# EAGLE design Zypher PCB (EAGLE 9.3.2)
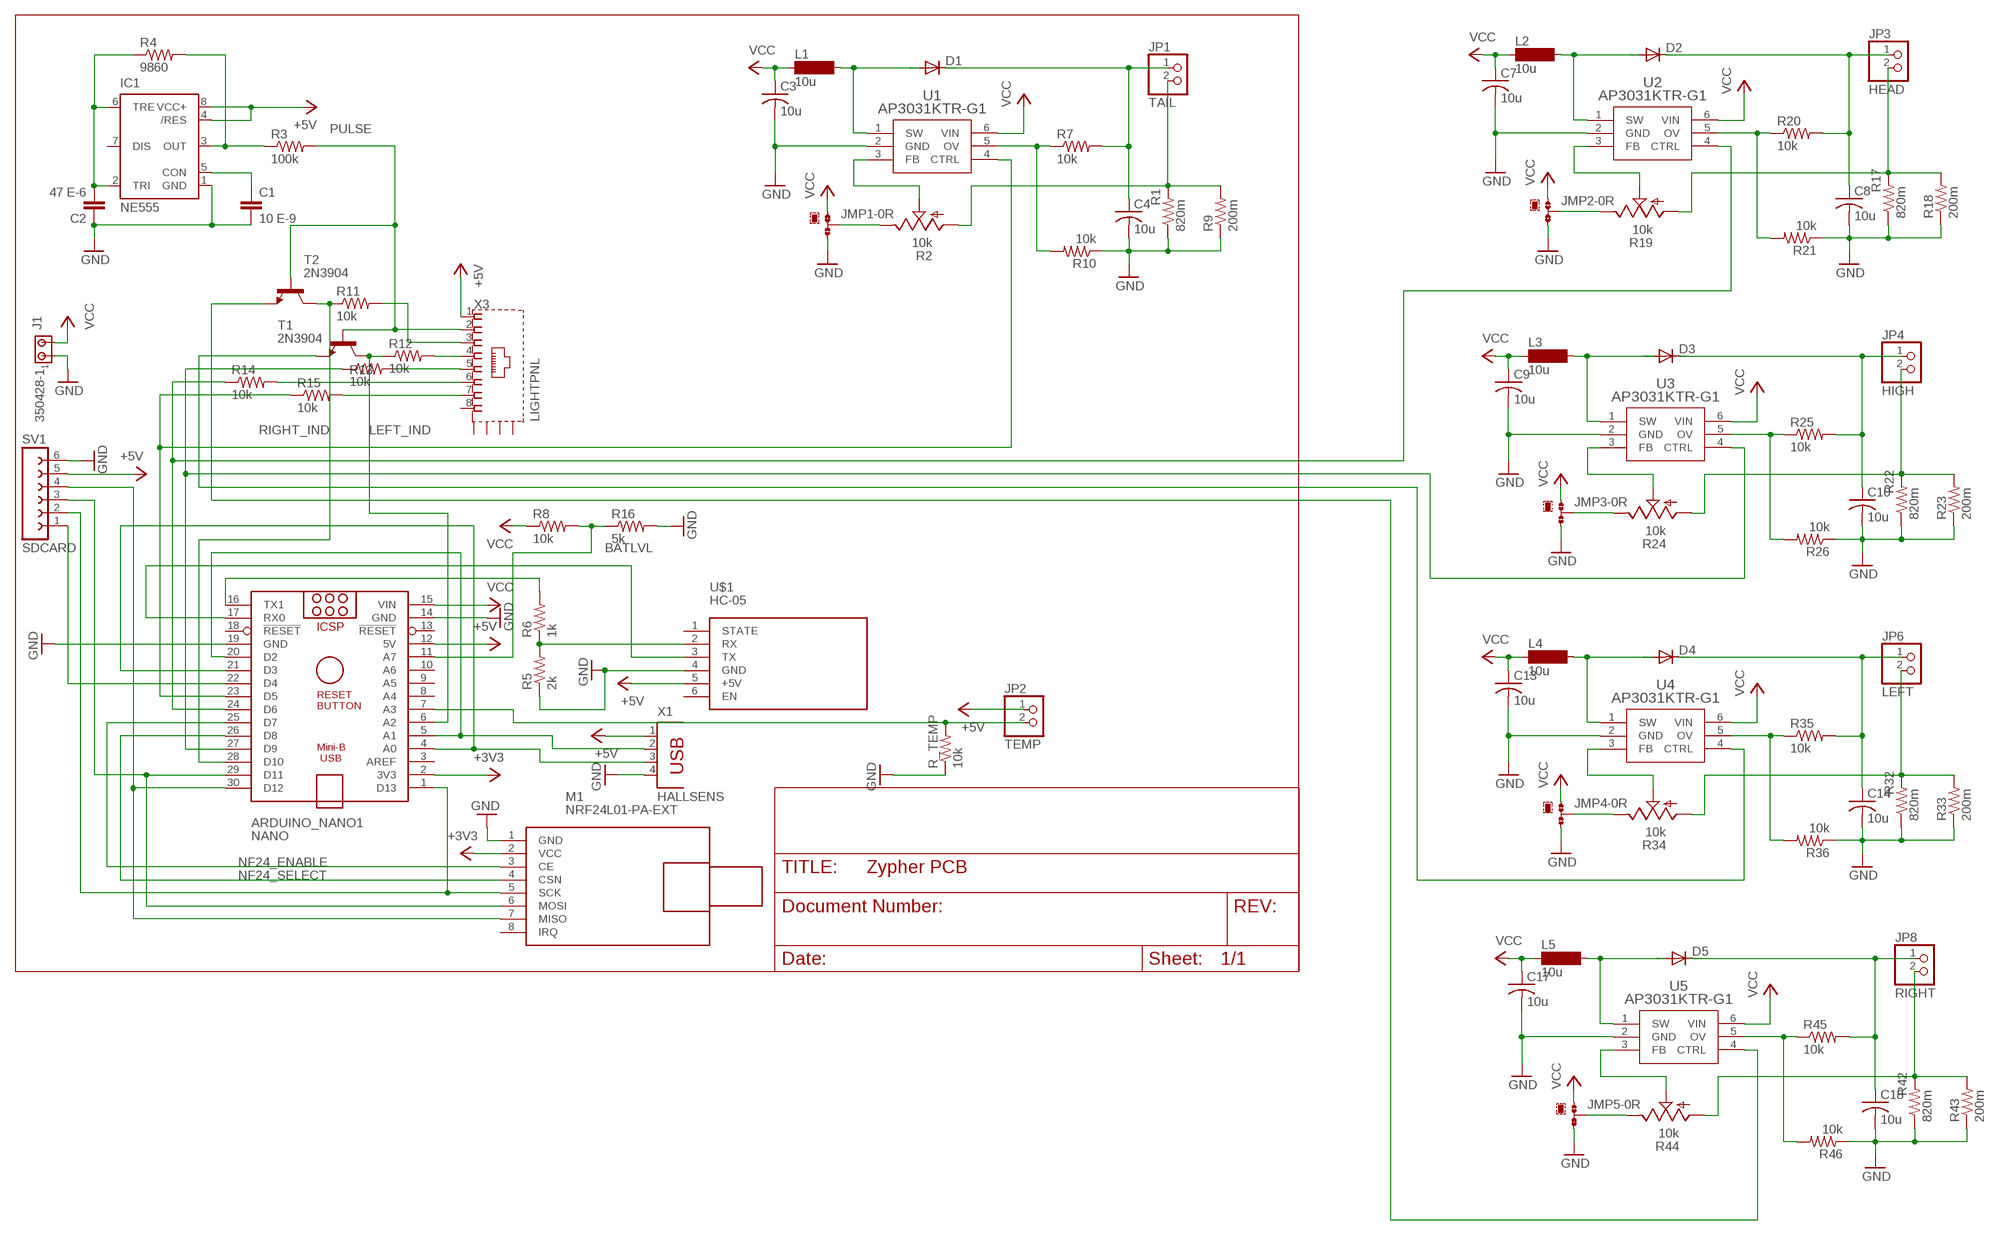
[diagram p0: schematic, sheet 1]

## Parts
ARDUINO_NANO1  NANO  ARDUINO_NANO  [ARDUINO_NANO]
C1  10 E-9  C2.5/5  [C2.5-5]
C2  47 E-6  C2.5/5  [C2.5-5]
C3  10u  C-USC1206K  [C1206K]
C4  10u  C-USC1206K  [C1206K]
C7  10u  C-USC1206K  [C1206K]
C8  10u  C-USC1206K  [C1206K]
C9  10u  C-USC1206K  [C1206K]
C10  10u  C-USC1206K  [C1206K]
C13  10u  C-USC1206K  [C1206K]
C14  10u  C-USC1206K  [C1206K]
C17  10u  C-USC1206K  [C1206K]
C18  10u  C-USC1206K  [C1206K]
D1  DIODE-DO-214AC  [DO-214AC]
D2  DIODE-DO-214AC  [DO-214AC]
D3  DIODE-DO-214AC  [DO-214AC]
D4  DIODE-DO-214AC  [DO-214AC]
D5  DIODE-DO-214AC  [DO-214AC]
IC1  NE555  [DIL-08]
J1  350428-1  [350428-1]
JMP1  0R-JUMPA  [A0R-JMP]
JMP2  0R-JUMPA  [A0R-JMP]
JMP3  0R-JUMPA  [A0R-JMP]
JMP4  0R-JUMPA  [A0R-JMP]
JMP5  0R-JUMPA  [A0R-JMP]
JP1  TAIL  PINHD-1X2  [1X02]
JP2  TEMP  PINHD-1X2  [1X02]
JP3  HEAD  PINHD-1X2  [1X02]
JP4  HIGH  PINHD-1X2  [1X02]
JP6  LEFT  PINHD-1X2  [1X02]
JP8  RIGHT  PINHD-1X2  [1X02]
L1  10u  SD12K100  [SD12K100]
L2  10u  SD12K100  [SD12K100]
L3  10u  SD12K100  [SD12K100]
L4  10u  SD12K100  [SD12K100]
L5  10u  SD12K100  [SD12K100]
M1  NRF24L01-PA-EXT  WIRELESS-NRF24L01-PA-EXT  [WIRELESS-NRF24L01-PA-EXT]
R1  820m  R-US_R0603  [R0603]
R2  10k  TRIM_US-RJ9W  [RJ9W]
R3  100k  R-US_0207/7  [0207/7]
R4  9860  R-US_0207/7  [0207/7]
R5  2k  R-US_0204/7  [0204/7]
R6  1k  R-US_0204/7  [0204/7]
R7  10k  R-US_0207/2V  [0207/2V]
R8  10k  R-US_0207/7  [0207/7]
R9  200m  R-US_R0805  [R0805]
R10  10k  R-US_0207/2V  [0207/2V]
R11  10k  R-US_0207/7  [0207/7]
R12  10k  R-US_0207/7  [0207/7]
R13  10k  R-US_0207/7  [0207/7]
R14  10k  R-US_0207/7  [0207/7]
R15  10k  R-US_0207/7  [0207/7]
R16  5k  R-US_0207/7  [0207/7]
R17  820m  R-US_R0603  [R0603]
R18  200m  R-US_R0805  [R0805]
R19  10k  TRIM_US-RJ9W  [RJ9W]
R20  10k  R-US_0207/2V  [0207/2V]
R21  10k  R-US_0207/2V  [0207/2V]
R22  820m  R-US_R0603  [R0603]
R23  200m  R-US_R0805  [R0805]
R24  10k  TRIM_US-RJ9W  [RJ9W]
R25  10k  R-US_0207/2V  [0207/2V]
R26  10k  R-US_0207/2V  [0207/2V]
R32  820m  R-US_R0603  [R0603]
R33  200m  R-US_R0805  [R0805]
R34  10k  TRIM_US-RJ9W  [RJ9W]
R35  10k  R-US_0207/2V  [0207/2V]
R36  10k  R-US_0207/2V  [0207/2V]
R42  820m  R-US_R0603  [R0603]
R43  200m  R-US_R0805  [R0805]
R44  10k  TRIM_US-RJ9W  [RJ9W]
R45  10k  R-US_0207/2V  [0207/2V]
R46  10k  R-US_0207/2V  [0207/2V]
R_TEMP  10k  R-US_0207/7  [0207/7]
SV1  SDCARD  FE06W  [FE06W]
T1  2N3904  [TO92]
T2  2N3904  [TO92]
U1  AP3031KTR-G1  [SOT23-6]
U2  AP3031KTR-G1  [SOT23-6]
U3  AP3031KTR-G1  [SOT23-6]
U4  AP3031KTR-G1  [SOT23-6]
U5  AP3031KTR-G1  [SOT23-6]
U$1  HC-05  WIRELESS-BLUETOOTH-HC-05  [WIRELESS-BLUETOOTH-HC-05]
X1  HALLSENS  PN87520  [PN87520]
X3  LIGHTPNL  RJ45-6L21-S  [RJ45-SHIELD1]

## Nets
+3V3: ARDUINO_NANO1.2(3V3) M1.2(VCC)
+5V: ARDUINO_NANO1.12(5V) IC1.4(/RES) IC1.8(VCC+) JP2.1 SV1.5 U$1.5(+5V) X1.1 X3.1
BATLVL: ARDUINO_NANO1.11(A7) R8.2 R16.1
CLK: ARDUINO_NANO1.1(D13) M1.5(SCK) SV1.2
GND: ARDUINO_NANO1.14(GND) ARDUINO_NANO1.19(GND) C1.2 C2.1 C3.2 C4.2 C7.2 C8.2 C9.2 C10.2 C13.2 C14.2 C17.2 C18.2 IC1.1(GND) J1.1 JMP1.3 JMP2.3 JMP3.3 JMP4.3 JMP5.3 M1.1(GND) R1.1 R5.1 R9.1 R10.1 R16.2 R17.1 R18.1 R21.1 R22.1 R23.1 R26.1 R32.1 R33.1 R36.1 R42.1 R43.1 R46.1 R_TEMP.1 SV1.6 U1.2(GND) U2.2(GND) U3.2(GND) U4.2(GND) U5.2(GND) U$1.4(GND) X1.4
HALL1: ARDUINO_NANO1.4(A0) ARDUINO_NANO1.21(D3) X1.3
HALL2: ARDUINO_NANO1.5(A1) ARDUINO_NANO1.20(D2) X1.2
HEAD_CTRL: ARDUINO_NANO1.24(D6) R14.1 U2.4(CTRL)
HIGH_CTRL: ARDUINO_NANO1.27(D9) R13.1 U3.4(CTRL)
LEFT+: C14.1 D4.C JP6.1 R35.2
LEFT-: JP6.2 R32.2 R33.2 R34.A
LEFT_CTRL: T1.3(E) U4.4(CTRL)
LEFT_IND: ARDUINO_NANO1.6(A2) R12.1 T1.1(C)
MISO: ARDUINO_NANO1.30(D12) M1.7(MISO) SV1.4
MOSI: ARDUINO_NANO1.29(D11) M1.6(MOSI) SV1.3
N$1: D1.A L1.2 U1.1(SW)
N$2: C1.1 IC1.5(CON)
N$3: C4.1 D1.C JP1.1 R7.2
N$4: C2.2 IC1.2(TRI) IC1.6(TRE) R4.1
N$5: IC1.3(OUT) R3.1 R4.2
N$6: R2.S U1.3(FB)
N$7: JP1.2 R1.2 R2.A R9.2
N$8: JMP1.2 R2.E
N$12: R5.2 R6.1 U$1.2(RX)
N$20: R7.1 R10.2 U1.5(OV)
N$26: R14.2 X3.6
N$28: R13.2 X3.5
N$29: R11.2 X3.3
N$30: R12.2 X3.4
N$31: R15.2 X3.7
N$35: D2.A L2.2 U2.1(SW)
N$36: C8.1 D2.C JP3.1 R20.2
N$37: JP3.2 R17.2 R18.2 R19.A
N$38: R19.S U2.3(FB)
N$39: JMP2.2 R19.E
N$40: R20.1 R21.2 U2.5(OV)
N$42: D3.A L3.2 U3.1(SW)
N$43: C10.1 D3.C JP4.1 R25.2
N$44: JP4.2 R22.2 R23.2 R24.A
N$45: R24.S U3.3(FB)
N$46: JMP3.2 R24.E
N$47: R25.1 R26.2 U3.5(OV)
N$56: D4.A L4.2 U4.1(SW)
N$59: R34.S U4.3(FB)
N$60: JMP4.2 R34.E
N$61: R35.1 R36.2 U4.5(OV)
N$70: D5.A L5.2 U5.1(SW)
N$73: R44.S U5.3(FB)
N$74: JMP5.2 R44.E
N$75: R45.1 R46.2 U5.5(OV)
NF24_ENABLE: ARDUINO_NANO1.25(D7) M1.3(CE)
NF24_SELECT: ARDUINO_NANO1.26(D8) M1.4(CSN)
PULSE: R3.2 T1.2(B) T2.2(B) X3.2
RIGHT+: C18.1 D5.C JP8.1 R45.2
RIGHT-: JP8.2 R42.2 R43.2 R44.A
RIGHT_CTRL: T2.3(E) U5.4(CTRL)
RIGHT_IND: ARDUINO_NANO1.28(D10) R11.1 T2.1(C)
RX: ARDUINO_NANO1.17(RX0) U$1.3(TX)
SD_SEL: ARDUINO_NANO1.22(D4) SV1.1
TAIL_CTRL: ARDUINO_NANO1.23(D5) R15.1 U1.4(CTRL)
TEMP: ARDUINO_NANO1.7(A3) JP2.2 R_TEMP.2
TX: ARDUINO_NANO1.16(TX1) R6.2
VCC: ARDUINO_NANO1.15(VIN) C3.1 C7.1 C9.1 C13.1 C17.1 J1.2 JMP1.1 JMP2.1 JMP3.1 JMP4.1 JMP5.1 L1.1 L2.1 L3.1 L4.1 L5.1 R8.1 U1.6(VIN) U2.6(VIN) U3.6(VIN) U4.6(VIN) U5.6(VIN)
Unconnected: ARDUINO_NANO1.3(AREF) ARDUINO_NANO1.8(A4) ARDUINO_NANO1.9(A5) ARDUINO_NANO1.10(A6) ARDUINO_NANO1.13(!RESET) ARDUINO_NANO1.18(!RESET) IC1.7(DIS) M1.8(IRQ) U$1.1(STATE) U$1.6(EN) X3.8 X3.S1(S) X3.S2(S) X3.S3(S) X3.S4(S)

## Library data of the parts
ARDUINO_NANO1 = MIE346, Design Assignment 3 - ArduinoNanoV40:ARDUINO_NANO: Arduino Nano V3.0 Overview: The Arduino Nano is a small, complete, and breadboard-friendly board based on the ATmega328 (Arduino Nano 3.x) or ATmega168 (Arduino Nano 2.x). It has more or less the same functionality of the Arduino Duemilanove, but in a different package. It lacks only a DC power jack, and works with a Mini-B USB cable instead of a standard one. The Nano was designed and is being produced by Gravitech. Specifications: Microcontroller Atmel ATmega168 or ATmega328 Operating Voltage (logic level) 5 V Input Voltage (recommended) 7-12 V Input Voltage (limits) 6-20 V Digital I/O Pins 14 (of which 6 provide PWM output) Analog Input Pins 8 DC Current per I/O Pin 40 mA Flash Memory 16 KB (ATmega168) or 32 KB (ATmega328) of which 2 KB used by bootloader SRAM 1 KB (ATmega168) or 2 KB (ATmega328) EEPROM 512 bytes (ATmega168) or 1 KB (ATmega328) Clock Speed 16 MHz Dimensions 0.73" x 1.70" Length 45 mm Width 18 mm Weigth 5 g Power: The Arduino Nano can be powered via the Mini-B USB connection, 6-20V unregulated external power supply (pin 30), or 5V regulated external power supply (pin 27). The power source is automatically selected to the highest voltage source. Memory: The ATmega168 has 16 KB of flash memory for storing code (of which 2 KB is used for the bootloader); the ATmega328 has 32 KB, (also with 2 KB used for the bootloader). The ATmega168 has 1 KB of SRAM and 512 bytes of EEPROM (which can be read and written with the EEPROM library); the ATmega328 has 2 KB of SRAM and 1 KB of EEPROM. Input and Output: Each of the 14 digital pins on the Nano can be used as an input or output, using pinMode(), digitalWrite(), and digitalRead() functions. They operate at 5 volts. Each pin can provide or receive a maximum of 40 mA and has an internal pull-up resistor (disconnected by default) of 20-50 kOhms. In addition, some pins have specialized functions. Visit Arduino - ArduinoBoardNano <https://www.arduino.cc/en/Main/ArduinoBoardNano>
C1 C2 = capacitor-wima:C: CAPACITOR naming: grid - package width
C3 C4 C7-C10 C13 C14 C17 C18 = rcl:C-US: CAPACITOR, American symbol; SPICEPREFIX: C
D1-D5 = diode:DIODE-: DIODE
IC1 = st-microelectronics:NE555: General purpose bipolar Timer; MF: Arrow Electronics; MPN: NE555N; OC_FARNELL: 1467742; OC_NEWARK: 89K1486
J1 = con-amp:350428-1: Universal MATE-N-LOK .250" Centerline, 600 V, 19 - 36 A max Source: http://catalog.tycoelectronics.com/ .. ENG_CD_350428_Y.pdf
JMP1-JMP5 = jump-0r-smd:0R-JUMP: SMD 0R 0805 Jumper
JP1-JP4 JP6 JP8 = pinhead:PINHD-1X2: PIN HEADER
L1-L5 = inductor-neosid:SD12: INDUCTOR nominal inductance; OC_FARNELL: unknown; OC_NEWARK: unknown
M1 = diy-modules:WIRELESS-NRF24L01-PA-EXT: 2.4 GHz Wireless Module based on NRF24L01 chip with preamplifier and external antenna Click here to find device on ebay.com <http://www.ebay.com/sch/nrf24l01+pa+lna+sma>
R1 R7 R9 R10 R17 R18 R20-R23 R25 R26 R32 R33 R35 R36 R42 R43 R45 R46 = resistor:R-US_: RESISTOR, American symbol
R2 R19 R24 R34 R44 = pot:TRIM_US-: POTENTIOMETER
R3-R6 R8 R11-R16 R_TEMP = rcl:R-US_: RESISTOR, American symbol; SPICEPREFIX: R
SV1 = con-lsta:FE06W: FEMALE HEADER; OC_FARNELL: unknown; OC_NEWARK: unknown
T1 T2 = transistor:2N3904: NPN TRANSISTOR
U1-U5 = Lighting IC:AP3031KTR-G1: AP3031 step-up LED driver chip for LEDs up to 1.4A; MANUFACTURER_PART_NUMBER: AP3031KTRG1; VENDOR: Diodes Inc
U$1 = diy-modules:WIRELESS-BLUETOOTH-HC-05: Bluetooth Transceiver Module based on HC-05 board Tutorial is available here: https://arduino-info.wikispaces.com/BlueTooth-HC05-HC06-Modules-How-To Click here to find device on ebay.com <http://www.ebay.com/sch/hc-05+module+rs232>
X1 = con-berg:PN87520: BERG USB connector; OC_FARNELL: unknown; OC_NEWARK: unknown
X3 = con-tycoelectronics:RJ45*2: RJ45 Low Profile Shield Type 2 For all RJ45 L, LC, LCT and X Series Models Source: www.tycoelectronics.com .. ENG_DS_1654001_1099_RJ_L_0507.pdf; OC_FARNELL: unknown; OC_NEWARK: unknown

## Net classes
0 default: width 0.254 mm, clearance 0.152 mm

## Board
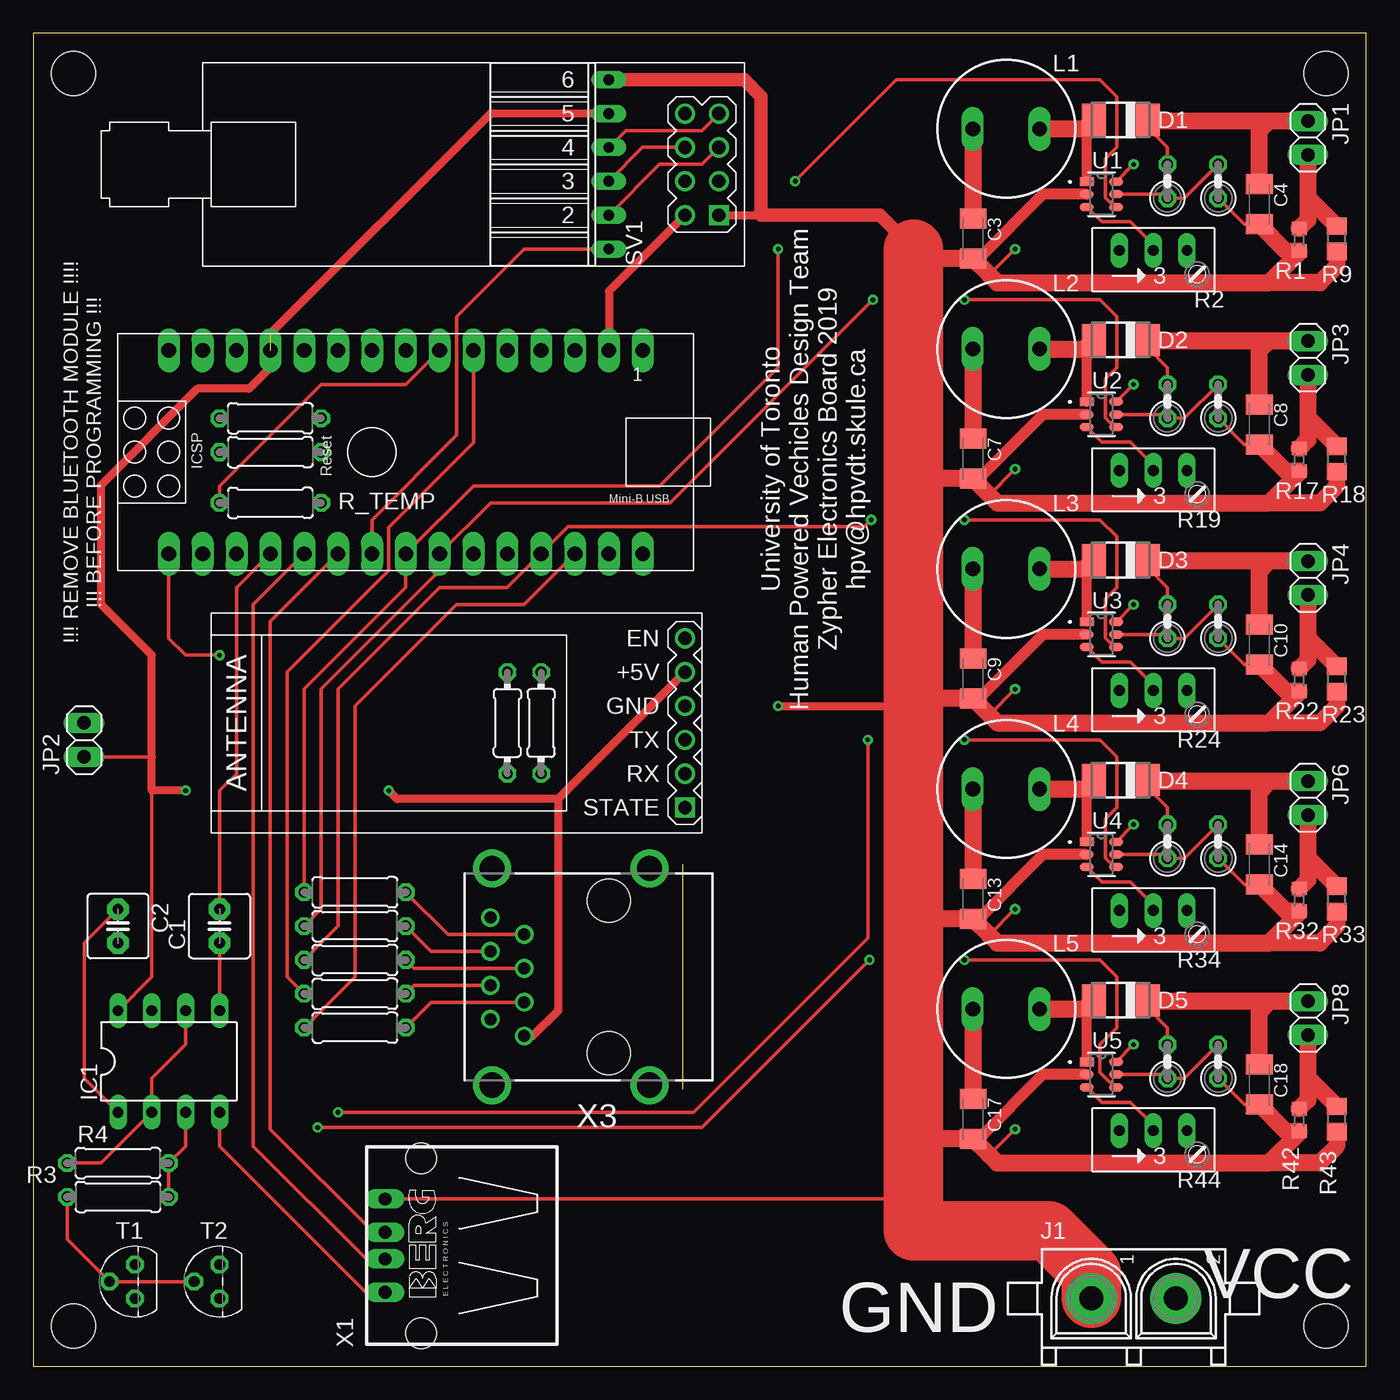
[diagram p1: board, top side]
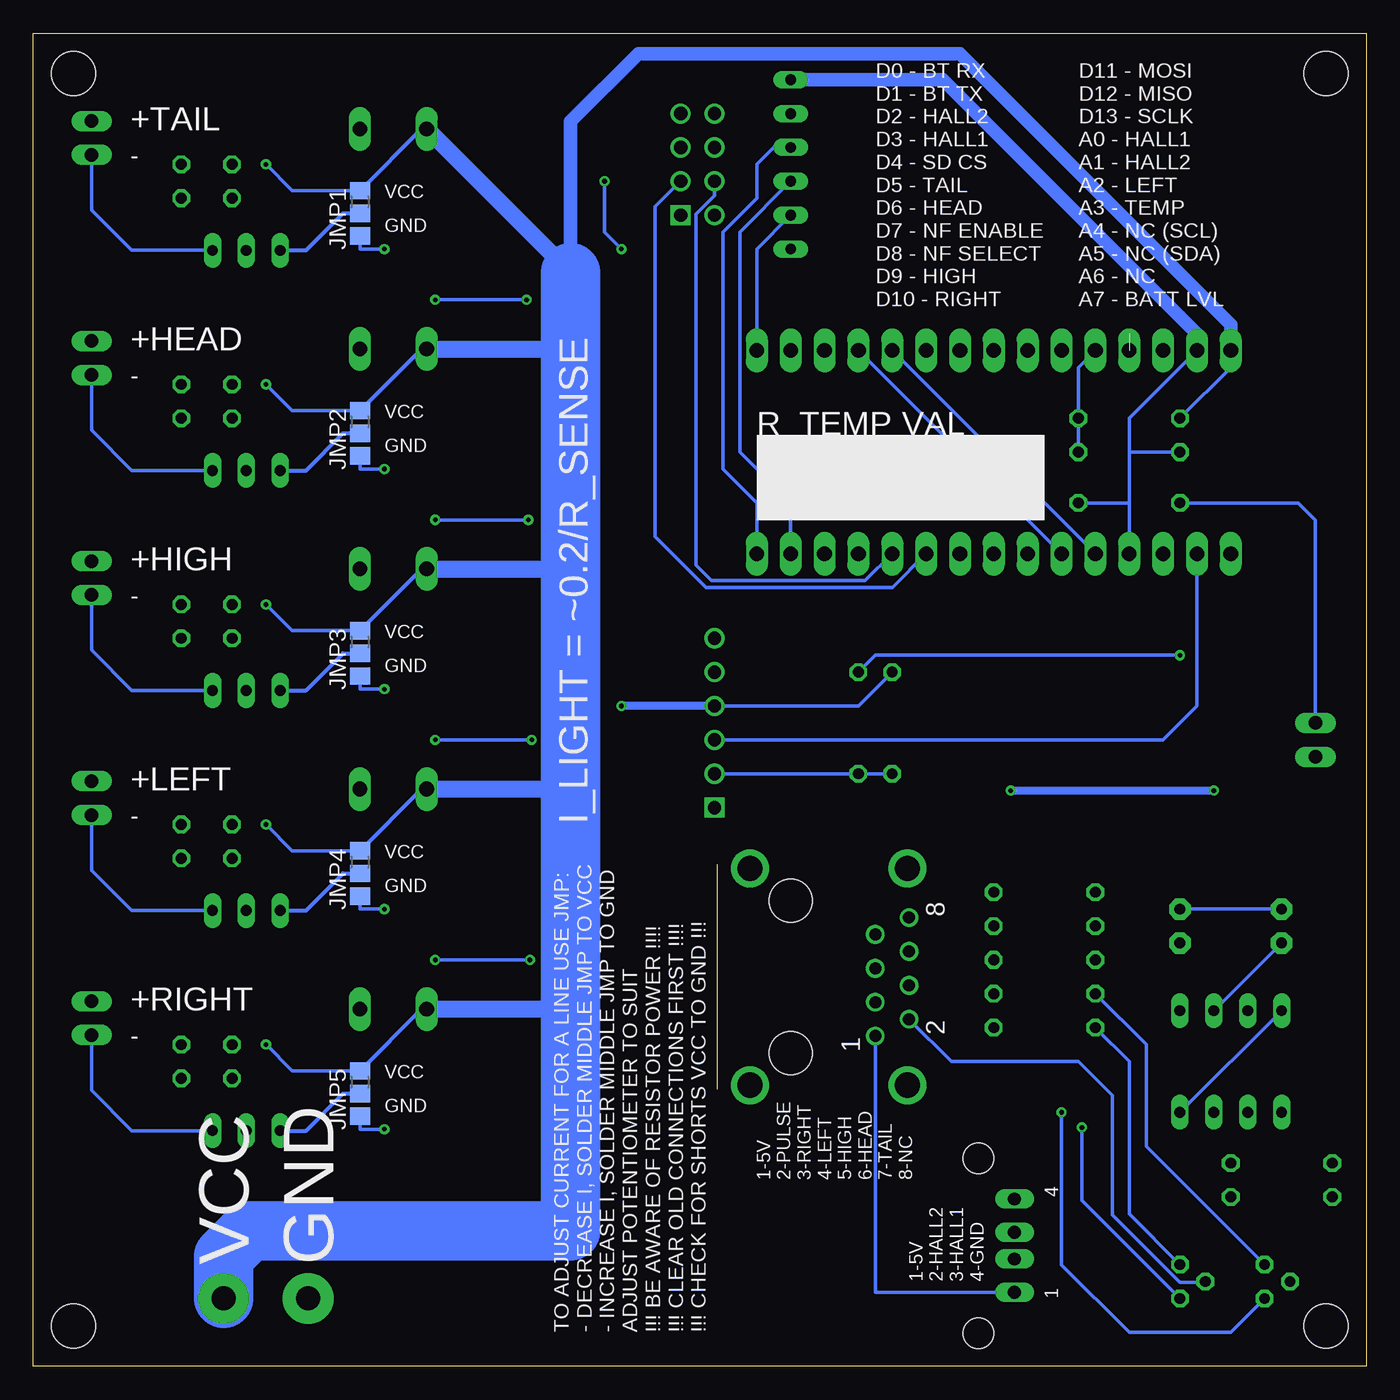
[diagram p2: board, bottom side, seen from below]

Size 100 x 100 mm. Coordinates in mm from the lower left corner, seen from the top.
Outline: 0,0 100,0 100,100 0,100 0,0
Copper layers (1*16): Top 0.035mm / dielectric 1.5mm / Bottom 0.035mm
Design rules "default *": minimum track width 10mil, minimum drill 0.35mm, track to track 6mil, track to pad 6mil, pad to pad 6mil, via to via 6mil, smd to smd 6mil, copper to edge 40mil, drill to drill 6mil, minimum pad ring 10mil, minimum via ring 8mil, stop-mask expansion 4mil, vias tented up to drill 0mil, thermal gap 10mil
Holes 3.3 mm at 3,97 97,3 3,3 97,97

### Footprints (pad centres in the part's own frame; a part is rotated, then mirrored left to right if it is on the bottom)
ARDUINO_NANO = drill 1.1 long: 1 -20.32,-7.62; 2 -17.78,-7.62; 3 -15.24,-7.62; 4 -12.7,-7.62; 5 -10.16,-7.62; 6 -7.62,-7.62; 7 -5.08,-7.62; 8 -2.54,-7.62; 9 0,-7.62; 10 2.54,-7.62; 11 5.08,-7.62; 12 7.62,-7.62; 13 10.16,-7.62; 14 12.7,-7.62; 15 15.24,-7.62; 16 15.24,7.62; 17 12.7,7.62; 18 10.16,7.62; 19 7.62,7.62; 20 5.08,7.62; 21 2.54,7.62; 22 0,7.62; 23 -2.54,7.62; 24 -5.08,7.62; 25 -7.62,7.62; 26 -10.16,7.62; 27 -12.7,7.62; 28 -15.24,7.62; 29 -17.78,7.62; 30 -20.32,7.62
C2.5-5 = drill 0.813 pad 1.6 octagon: 1 -1.27,0; 2 1.27,0
C1206K = smd 1.5 x 2: 1 -1.5,0; 2 1.5,0
DO-214AC = smd 1.8 x 2.4: A 2.025,0; C -2.025,0
DIL-08 = drill 0.813 long: 1 -3.81,-3.81; 2 -1.27,-3.81; 3 1.27,-3.81; 4 3.81,-3.81; 5 3.81,3.81; 6 1.27,3.81; 7 -1.27,3.81; 8 -3.81,3.81
350428-1 = drill 1.8 pad 3.81: 1 -3.175,0; 2 3.175,0
A0R-JMP = smd 1.5 x 1.3: 1 0,1.7; 2 0,0; 3 0,-1.7
1X02 = drill 1.016 long: 1 -1.27,0; 2 1.27,0
SD12K100 = drill 1.1 long: 1 -2.5,0; 2 2.5,0
WIRELESS-NRF24L01-PA-EXT = drill 1 square: 1 -18.415,3.81 | drill 1: 2 -15.875,3.81; 3 -18.415,1.27; 4 -15.875,1.27; 5 -18.415,-1.27; 6 -15.875,-1.27; 7 -18.415,-3.81; 8 -15.875,-3.81
R0603 = smd 1 x 1.1: 1 -0.85,0; 2 0.85,0
RJ9W = drill 0.813 long: A 2.54,0.635; E -2.54,0.635; S 0,0.635
0207/7 = drill 0.813 octagon: 1 -3.81,0; 2 3.81,0
0204/7 = drill 0.813 octagon: 1 -3.81,0; 2 3.81,0
0207/2V = drill 0.813 octagon: 1 -1.27,0; 2 1.27,0
R0805 = smd 1.3 x 1.5: 1 -0.95,0; 2 0.95,0
FE06W = drill 0.813 long: 1 -6.35,0; 2 -3.81,0; 3 -1.27,0; 4 1.27,0; 5 3.81,0; 6 6.35,0
TO92 = drill 0.813 octagon: 1 1.27,0; 2 0,1.905; 3 -1.27,0
SOT23-6 = smd 1.06 x 0.65: 1 -1.1,0.95; 2 -1.1,0; 3 -1.1,-0.95; 4 1.1,-0.95; 5 1.1,0; 6 1.1,0.95
WIRELESS-BLUETOOTH-HC-05 = drill 1 square: 1 -6.35,-17.145 | drill 1: 2 -3.81,-17.145; 3 -1.27,-17.145; 4 1.27,-17.145; 5 3.81,-17.145; 6 6.35,-17.145
PN87520 = drill 0.95 long: 1 -3.5,2.71; 2 -1,2.71; 3 1,2.71; 4 3.5,2.71 | hole 2.3: -6.57,0; 6.57,0
RJ45-SHIELD1 = drill 0.9 pad 1.4: 1 -4.445,6.35; 2 -3.175,8.89; 3 -1.905,6.35; 4 -0.635,8.89; 5 0.635,6.35; 6 1.905,8.89; 7 3.175,6.35; 8 4.445,8.89 | drill 1.9 pad 2.5: S1 -8.128,-3.048; S2 8.128,-3.048; S3 -8.128,8.76; S4 8.128,8.76 | hole 3.251: -5.715,0; 5.715,0

### Placement (x,y rotation side)
ARDUINO_NANO1  25.4,68.58 180 top
C1  13.97,33.02 90 top
C2  6.35,33.02 270 top
C3  70.5,84.6 270 top
C4  91.98,87.17 270 top
C7  70.5,68.09 270 top
C8  91.98,70.66 270 top
C9  70.5,51.58 270 top
C10  91.98,54.15 270 top
C13  70.5,35.07 270 top
C14  91.98,37.64 270 top
C17  70.5,18.56 270 top
C18  91.98,21.13 270 top
D1  81.58,93.5 180 top
D2  81.58,76.99 180 top
D3  81.58,60.48 180 top
D4  81.58,43.97 180 top
D5  81.58,27.46 180 top
IC1  10.16,22.86 0 top
J1  82.55,5.08 0 top
JMP1  75.49,86.5 0 bottom
JMP2  75.49,69.99 0 bottom
JMP3  75.49,53.48 0 bottom
JMP4  75.49,36.97 0 bottom
JMP5  75.49,20.46 0 bottom
JP1  95.62,92.15 270 top
JP2  3.81,46.99 90 top
JP3  95.62,75.64 270 top
JP4  95.62,59.13 270 top
JP6  95.62,42.62 270 top
JP8  95.62,26.11 270 top
L1  72.99,92.83 0 top
L2  72.99,76.32 0 top
L3  72.99,59.81 0 top
L4  72.99,43.3 0 top
L5  72.99,26.79 0 top
M1  33.02,90.17 180 top
R1  94.98,84.52 90 top
R2  84.02,83.08 0 top
R3  6.35,12.7 180 top
R4  6.35,15.24 0 top
R5  35.56,48.26 270 top
R6  38.1,48.26 90 top
R7  85.09,88.9 90 top
R8  17.78,71.12 0 top
R9  97.79,84.58 90 top
R10  88.9,88.9 90 top
R11  24.13,25.4 0 top
R12  24.13,27.94 0 top
R13  24.13,30.48 0 top
R14  24.13,33.02 0 top
R15  24.13,35.56 0 top
R16  17.78,68.58 180 top
R17  94.98,68.01 90 top
R18  97.79,68.07 90 top
R19  84.02,66.57 0 top
R20  85.09,72.39 90 top
R21  88.9,72.39 90 top
R22  94.98,51.5 90 top
R23  97.79,51.56 90 top
R24  84.02,50.06 0 top
R25  85.09,55.88 90 top
R26  88.9,55.88 90 top
R32  94.98,34.99 90 top
R33  97.79,35.05 90 top
R34  84.02,33.55 0 top
R35  85.09,39.37 90 top
R36  88.9,39.37 90 top
R42  94.98,18.48 90 top
R43  97.79,18.54 90 top
R44  84.02,17.04 0 top
R45  85.09,22.86 90 top
R46  88.9,22.86 90 top
R_TEMP  17.78,64.77 180 top
SV1  43.18,90.17 90 top
T1  7.62,6.35 90 top
T2  13.97,6.35 90 top
U1  80.14,87.92 0 top
U2  80.14,71.41 0 top
U3  80.14,54.9 0 top
U4  80.14,38.39 0 top
U5  80.14,21.88 0 top
U$1  31.75,48.26 90 top
X1  29.1,9.04 90 top
X3  43.18,29.21 90 top

### Tracks (layer width: path | path; a pad name or v marks a point on that pad's centre or on a via)
+3V3
  Top 0.61: M1.2 43.18,80.64 ARDUINO_NANO1.2
+5V  (via drill 0.35)  (1 unrouted)
  Top 0.254: IC1.8 8.89,29.21 8.89,43.18 | IC1.4 13.97,16.51 24.94,5.54 X1.1 | JP2.1 8.89,45.72
  Top 0.61: SV1.5 34.29,93.98 17.78,77.47 17.78,74.93 16.18,73.33 12.31,73.33 5.08,66.1 5.08,57.15 8.89,53.34 8.89,45.72 8.89,43.18 v11.43,43.18 | U$1.5 39.37,42.55 | 39.37,42.55 39.37,26.67 37.47,24.77 X3.1 | 39.37,42.55 27.3,42.55 v26.67,43.18
  Bottom 0.254: IC1.4 IC1.8 | X1.1 36.83,5.54 X3.1
  Bottom 0.61: v26.67,43.18 v11.43,43.18
BATLVL
  Bottom 0.254: R16.1 R8.2 21.59,74.93 ARDUINO_NANO1.11
CLK
  Top 0.254: SV1.2 46.99,90.17 50.16,90.17 M1.5
  Bottom 0.254: SV1.2 45.72,83.82 ARDUINO_NANO1.1
GND  (via drill 0.35)
  Top 0.254: IC1.1 3.81,21.59 3.81,31.75 C2.1 | v73.66,83.82 71.72,81.88 | R10.1 90.86,85.67 C4.2 | v73.66,67.31 71.72,65.37 | R21.1 90.86,69.16 C8.2 | v73.66,50.8 71.72,48.86 | R26.1 90.86,52.65 C10.2 | v73.66,34.29 71.72,32.35 | R36.1 90.86,36.14 C14.2 | v73.66,17.78 71.72,15.84 | R46.1 90.86,19.63 C18.2 | X1.4 65.88,12.54 66.04,12.7 | 64.77,49.53 66.04,50.8 | C1.2 13.97,43.18 15.24,44.45 15.24,58.42 ARDUINO_NANO1.19
  Top 0.61: v55.88,49.53 64.77,49.53 | M1.1 54.61,86.36
  Top 0.813: U1.2 75.76,87.92 70.94,83.1 C3.2 | U2.2 75.76,71.41 70.94,66.59 C7.2 | U3.2 75.76,54.9 70.94,50.08 C9.2 | U4.2 75.76,38.39 70.94,33.57 C13.2 | U5.2 75.76,21.88 70.94,17.06 C17.2
  Top 1.016: 66.04,83.82 63.5,86.36 54.61,86.36 54.61,95.25 53.34,96.52 SV1.6
  Top 1.27: C4.2 93.98,83.67 R1.1 94.98,83.55 92.71,81.28 | 92.71,81.28 72.32,81.28 71.72,81.88 C3.2 66.76,83.1 66.04,83.82 | R9.1 97.79,82.55 96.52,81.28 92.71,81.28 | C8.2 93.98,67.16 R17.1 94.98,67.04 92.71,64.77 | 92.71,64.77 72.32,64.77 71.72,65.37 C7.2 66.76,66.59 66.04,67.31 | R18.1 97.79,66.04 96.52,64.77 92.71,64.77 | C10.2 93.98,50.65 R22.1 94.98,50.53 92.71,48.26 | 92.71,48.26 72.32,48.26 71.72,48.86 C9.2 66.76,50.08 66.04,50.8 | R23.1 97.79,49.53 96.52,48.26 92.71,48.26 | C14.2 93.98,34.14 R32.1 94.98,34.02 92.71,31.75 | 92.71,31.75 72.32,31.75 71.72,32.35 C13.2 66.76,33.57 66.04,34.29 | R33.1 97.79,33.02 96.52,31.75 92.71,31.75 | C18.2 93.98,17.63 R42.1 94.98,17.51 92.71,15.24 | 92.71,15.24 72.32,15.24 71.72,15.84 C17.2 66.76,17.06 66.04,17.78 | R43.1 97.79,16.51 96.52,15.24 92.71,15.24
  Top 4.445: J1.1 79.38,6.99 76.2,10.16 66.04,10.16 66.04,12.7 66.04,17.78 66.04,34.29 66.04,50.8 66.04,67.31 66.04,83.82
  Bottom 0.254: C2.1 C1.2 | 17.78,64.77 17.78,68.58 | 17.78,68.58 17.78,71.12 ARDUINO_NANO1.14 | JMP1.3 75.49,83.82 v73.66,83.82 | JMP2.3 75.49,67.31 v73.66,67.31 | JMP3.3 75.49,50.8 v73.66,50.8 | JMP4.3 75.49,34.29 v73.66,34.29 | JMP5.3 75.49,17.78 v73.66,17.78 | R16.2 17.78,68.58 | R5.1 38.1,49.53 U$1.4 | R_TEMP.1 17.78,64.77 | ARDUINO_NANO1.19 17.78,64.77
  Bottom 0.61: U$1.4 v55.88,49.53
  Bottom 1.016: ARDUINO_NANO1.14 12.7,77.47 31.75,96.52 SV1.6
HALL1
  Top 0.254: X1.3 25.52,10.04 17.78,17.78 17.78,55.88 ARDUINO_NANO1.21
  Bottom 0.254: ARDUINO_NANO1.4 ARDUINO_NANO1.21
HALL2
  Top 0.254: X1.2 24.98,8.04 16.51,16.51 16.51,57.15 ARDUINO_NANO1.20
  Bottom 0.254: ARDUINO_NANO1.5 ARDUINO_NANO1.20
HEAD_CTRL  (via drill 0.35)
  Top 0.254: U2.4 80.89,70.81 80.78,70.81 80.43,71.16 80.43,74.08 81.28,74.93 81.28,78.74 80.01,80.01 v69.85,80.01 | v62.99,80.01 47.75,64.77 34.29,64.77 ARDUINO_NANO1.24 30.48,59.69 21.59,50.8 21.59,34.29 R14.1
  Bottom 0.254: v69.85,80.01 v62.99,80.01
HIGH_CTRL  (via drill 0.35)
  Top 0.254: U3.4 80.89,54.3 80.78,54.3 80.43,54.65 80.43,57.57 81.28,58.42 81.28,62.23 80.01,63.5 v69.85,63.5 | v62.87,63.5 62.36,62.99 40.13,62.99 ARDUINO_NANO1.27 35.56,58.42 30.48,58.42 22.86,50.8 22.86,33.02 R13.1
  Bottom 0.254: v69.85,63.5 v62.87,63.5
LEFT+
  Top 0.254: R35.2 85.09,41.91 83.61,43.4
  Top 0.305: 83.61,43.4 D4.C
  Top 1.27: D4.C 83.68,43.89 92.71,43.89 | C14.1 91.98,43.1 92.71,43.83 92.71,43.89 | 92.71,43.89 JP6.1
LEFT-
  Top 1.27: R32.2 95.62,36.48 95.62,38.1 | JP6.2 95.62,38.1 | R33.2 95.69,38.1 95.62,38.1
  Bottom 0.254: JP6.2 95.62,37.2 92.61,34.19 R34.A
LEFT_CTRL  (via drill 0.35)
  Top 0.254: U4.4 80.89,37.79 80.78,37.79 80.43,38.14 80.43,41.06 81.28,41.91 81.28,45.72 80.01,46.99 v69.85,46.99 | v22.86,19.05 49.53,19.05 62.61,32.13 v62.61,46.99
  Bottom 0.254: v69.85,46.99 v62.61,46.99 | T1.3 10.16,2.54 17.78,2.54 22.86,7.62 v22.86,19.05
LEFT_IND
  Top 0.254: R12.1 19.05,29.21 19.05,52.07 26.67,59.69 26.67,62.92 33.02,69.28 ARDUINO_NANO1.6
  Bottom 0.254: T1.1 16.51,16.51 16.51,24.13 R12.1
MISO
  Top 0.254: SV1.4 44.45,92.71 50.16,92.71 M1.7
  Bottom 0.254: SV1.4 44.45,91.44 45.72,90.17 45.72,87.63 48.26,85.09 48.26,67.31 45.72,64.77 ARDUINO_NANO1.30
MOSI
  Top 0.254: SV1.3 45.72,91.44 M1.6
  Bottom 0.254: ARDUINO_NANO1.29 43.18,64.77 46.99,68.58 46.99,85.09 SV1.3
N$1
  Top 0.762: U1.1 79.04,92.94
  Top 0.813: 79.04,92.94 79.02,92.96
  Top 1.27: L1.2 78.89,92.83 79.02,92.96 D1.A
N$2
  Top 0.254: IC1.5 C1.1
N$3
  Top 0.254: R7.2 85.09,91.44 83.61,92.92
  Top 0.305: 83.61,92.92 D1.C
  Top 1.27: D1.C 83.68,93.42 92.71,93.42 | JP1.1 92.71,93.42 | 92.71,93.42 91.98,92.69 C4.1
N$4
  Top 0.254: IC1.6 11.43,24.13 8.89,21.59 IC1.2 5.08,15.24 R4.1
  Bottom 0.254: IC1.6 C2.2
N$5
  Top 0.254: IC1.3 11.43,16.51 R4.2 R3.1
N$6
  Top 0.254: U1.3 80.16,85.85 82.3,85.85 84.02,84.13 R2.S
N$7
  Top 1.27: R1.2 95.62,86.01 95.62,87.63 | JP1.2 95.62,87.63 | R9.2 95.69,87.63 95.62,87.63
  Bottom 0.254: JP1.2 95.62,86.73 92.61,83.72 R2.A
N$8
  Bottom 0.305: R2.E 79.55,83.72 76.76,86.5 JMP1.2
N$12
  Bottom 0.254: R5.2 R6.1 U$1.2
N$20
  Top 0.254: U1.5 84.8,87.92 R7.1 86.36,87.63 R10.2
N$26
  Top 0.254: X3.6 29.84,31.11 R14.2
N$28
  Top 0.254: X3.5 28.57,29.84 R13.2
N$29
  Top 0.254: X3.3 29.84,27.3 R11.2
N$30
  Top 0.254: X3.4 28.57,28.57 R12.2
N$31
  Top 0.254: X3.7 31.11,32.38 R15.2
N$35
  Top 0.762: U2.1 79.04,76.42
  Top 0.813: 79.04,76.42 79.02,76.45
  Top 1.27: L2.2 78.89,76.32 79.02,76.45 D2.A
N$36
  Top 0.254: R20.2 85.09,74.93 83.61,76.42
  Top 0.305: 83.61,76.42 D2.C
  Top 1.27: JP3.1 92.71,76.91 | 92.71,76.91 83.68,76.91 D2.C | 92.71,76.91 91.98,76.18 C8.1
N$37
  Top 1.27: R17.2 95.62,69.5 95.62,71.12 | JP3.2 95.62,71.12 | R18.2 95.69,71.12 95.62,71.12
  Bottom 0.254: JP3.2 95.62,70.22 92.61,67.2 R19.A
N$38
  Top 0.254: U2.3 80.16,69.34 82.3,69.34 84.02,67.62 R19.S
N$39
  Bottom 0.305: R19.E 79.55,67.2 76.76,69.99 JMP2.2
N$40
  Top 0.254: U2.5 84.8,71.41 R20.1 86.36,71.12 R21.2
N$42
  Top 0.762: U3.1 79.04,59.91
  Top 0.813: 79.04,59.91 79.02,59.94
  Top 1.27: L3.2 78.89,59.81 79.02,59.94 D3.A
N$43
  Top 0.254: R25.2 85.09,58.42 83.61,59.91
  Top 0.305: 83.61,59.91 D3.C
  Top 1.27: JP4.1 92.71,60.4 | 92.71,60.4 83.68,60.4 D3.C | 92.71,60.4 91.98,59.67 C10.1
N$44
  Top 1.27: R22.2 95.62,52.99 95.62,54.61 | JP4.2 95.62,54.61 | R23.2 95.69,54.61 95.62,54.61
  Bottom 0.254: JP4.2 95.62,53.71 92.61,50.7 R24.A
N$45
  Top 0.254: U3.3 80.16,52.83 82.3,52.83 84.02,51.11 R24.S
N$46
  Bottom 0.305: R24.E 79.55,50.7 76.76,53.48 JMP3.2
N$47
  Top 0.254: U3.5 84.8,54.9 R25.1 86.36,54.61 R26.2
N$56
  Top 0.762: U4.1 79.04,43.41
  Top 0.813: 79.04,43.41 79.02,43.43
  Top 1.27: L4.2 78.89,43.3 79.02,43.43 D4.A
N$59
  Top 0.254: U4.3 80.16,36.32 82.3,36.32 84.02,34.6 R34.S
N$60
  Bottom 0.305: R34.E 79.55,34.19 76.76,36.97 JMP4.2
N$61
  Top 0.254: U4.5 84.8,38.39 R35.1 86.36,38.1 R36.2
N$70
  Top 0.762: U5.1 79.04,26.89
  Top 0.813: 79.04,26.89 79.02,26.92
  Top 1.27: L5.2 78.89,26.79 79.02,26.92 D5.A
N$73
  Top 0.254: U5.3 80.16,19.81 82.3,19.81 84.02,18.09 R44.S
N$74
  Bottom 0.305: R44.E 79.55,17.68 76.76,20.46 JMP5.2
N$75
  Top 0.254: U5.5 84.8,21.88 R45.1 86.36,21.59 R46.2
NF24_ENABLE
  Bottom 0.254: M1.3 53.34,87 53.34,62.23 49.53,58.42 35.56,58.42 ARDUINO_NANO1.25
NF24_SELECT
  Bottom 0.254: M1.4 48.9,87.82 50.29,86.42 50.29,60.12 49.1,58.93 38.1,58.93 37.59,58.93 ARDUINO_NANO1.26
PULSE
  Top 0.254: R3.2 2.54,9.53 T1.2 T2.2
  Bottom 0.254: T2.2 12.12,6.3 13.98,6.3 19.05,11.37 19.05,20.32 21.59,22.86 31.11,22.86 X3.2
RIGHT+
  Top 0.254: R45.2 85.09,25.4 83.61,26.89
  Top 0.305: 83.61,26.89 D5.C
  Top 1.27: JP8.1 92.71,27.38 | 92.71,27.38 83.68,27.38 D5.C | C18.1 91.98,26.59 92.71,27.32 92.71,27.38
RIGHT-
  Top 1.27: R42.2 95.62,19.97 95.62,21.59 | JP8.2 95.62,21.59 | R43.2 95.69,21.59 95.62,21.59
  Bottom 0.254: JP8.2 95.62,20.69 92.61,17.68 R44.A
RIGHT_CTRL  (via drill 0.35)
  Top 0.254: U5.4 80.89,21.28 80.78,21.28 80.01,22.05 80.01,24.13 81.28,25.4 81.28,29.21 80.01,30.48 v69.85,30.48 | v62.74,30.48 50.16,17.91 v21.34,17.91
  Bottom 0.254: v69.85,30.48 v62.74,30.48 | v21.34,17.91 21.34,12.45 T2.3
RIGHT_IND
  Top 0.254: R11.1 24.13,29.21 24.13,49.53 31.75,57.15 36.83,57.15 ARDUINO_NANO1.28
  Bottom 0.254: R11.1 17.78,22.86 17.78,11.43 T2.1
RX
  Bottom 0.254: U$1.3 15.24,46.99 12.7,49.53 ARDUINO_NANO1.17
SD_SEL
  Top 0.254: SV1.1 36.83,83.82 31.75,78.74 31.75,69.85 25.4,63.5 ARDUINO_NANO1.22
TAIL_CTRL  (via drill 0.35)
  Top 0.254: U1.4 80.89,87.32 80.78,87.32 80.43,87.67 80.43,90.59 81.28,91.44 81.28,95.25 80.01,96.52 64.77,96.52 v57.15,88.9 | v55.88,83.82 55.88,74.93 46.99,66.04 33.02,66.04 ARDUINO_NANO1.23 27.94,58.42 20.32,50.8 R15.1
  Bottom 0.254: v57.15,88.9 57.15,85.09 v55.88,83.82
TEMP
  Top 0.254: R_TEMP.2 13.97,66.04 21.59,73.66 27.94,73.66 ARDUINO_NANO1.7
  Bottom 0.254: JP2.2 3.81,63.5 5.08,64.77 R_TEMP.2
TX  (via drill 0.35)
  Top 0.254: v13.97,53.34 11.43,53.34 10.16,54.61 ARDUINO_NANO1.16
  Bottom 0.254: R6.2 36.83,53.34 v13.97,53.34
VCC  (via drill 0.35)
  Top 0.254: v82.55,90.17 v82.54,90.17 U1.6 | v82.55,73.66 v82.54,73.66 U2.6 | v82.55,57.15 v82.54,57.15 U3.6 | v82.55,40.64 v82.54,40.64 U4.6 | v82.55,24.13 v82.54,24.13 U5.6
  Top 1.27: L1.1 C3.1 | L2.1 C7.1 | L3.1 C9.1 | L4.1 C13.1 | L5.1 C17.1
  Bottom 0.254: JMP1.1 80.58,88.2 v82.55,90.17 | JMP2.1 80.58,71.69 v82.55,73.66 | JMP3.1 80.58,55.18 v82.55,57.15 | JMP4.1 80.58,38.67 v82.55,40.64 | JMP5.1 80.58,22.16 v82.55,24.13 | R8.1 10.16,74.93 ARDUINO_NANO1.15
  Bottom 0.305: JMP1.1 70.86,92.83 L1.1 | JMP2.1 70.86,76.32 L2.1 | JMP3.1 70.86,59.81 L3.1 | JMP4.1 70.86,43.3 L4.1 | JMP5.1 70.86,26.79 L5.1
  Bottom 1.016: 59.69,82.03 59.69,93.4 54.61,98.48 31.75,98.48 31.17,98.48 30.48,98.48 10.16,78.16 ARDUINO_NANO1.15
  Bottom 1.27: L1.1 59.69,82.03 | L5.1 59.81,26.79 59.69,26.67 | L4.1 59.81,43.3 59.69,43.18 | L3.1 59.81,59.81 59.69,59.69 | L2.1 59.81,76.32 59.69,76.2
  Bottom 4.445: J1.2 85.72,8.26 83.82,10.16 59.69,10.16 59.69,26.67 59.69,43.18 59.69,59.69 59.69,76.2 59.69,82.03

### Text on the board
tNames: !!! REMOVE BLUETOOTH MODULE !!!! / !!! BEFORE PROGRAMMING !!! | University of Toronto / Human Powered Vechicles Design Team / Zypher Electronics Board 2019 / hpv@hpvdt.skule.ca | VCC | GND
bNames: D11 - MOSI / D12 - MISO / D13 - SCLK / A0 - HALL1 / A1 - HALL2 / A2 - LEFT / A3 - TEMP / A4 - NC (SCL) / A5 - NC (SDA) / A6 - NC / A7 - BATT LVL | D0 - BT RX / D1 - BT TX / D2 - HALL2 / D3 - HALL1 / D4 - SD CS / D5 - TAIL / D6 - HEAD / D7 - NF ENABLE / D8 - NF SELECT / D9 - HIGH / D10 - RIGHT | +TAIL | - | VCC | GND | +HEAD | - | VCC | R_TEMP VAL | GND | +HIGH | - | VCC | GND | +LEFT | I_LIGHT = ~0.2/R_SENSE | - | VCC | GND | 8 | +RIGHT | 2 | 1 | - | VCC | GND | 1-5V / 2-PULSE / 3-RIGHT / 4-LEFT / 5-HIGH / 6-HEAD / 7-TAIL / 8-NC | 4 | GND | VCC | 1-5V / 2-HALL2 / 3-HALL1 / 4-GND | 1 | TO ADJUST CURRENT FOR A LINE USE JMP: / - DECREASE I, SOLDER MIDDLE JMP TO VCC / - INCREASE I, SOLDER MIDDLE JMP TO GND / ADJUST POTENTIOMETER TO SUIT / !!! BE AWARE OF RESISTOR POWER !!!! / !!! CLEAR OLD CONNECTIONS FIRST !!!! / !!! CHECK FOR SHORTS VCC TO GND !!!